# Altium schematic sheet 9.7-13.3.SchDoc
size A4
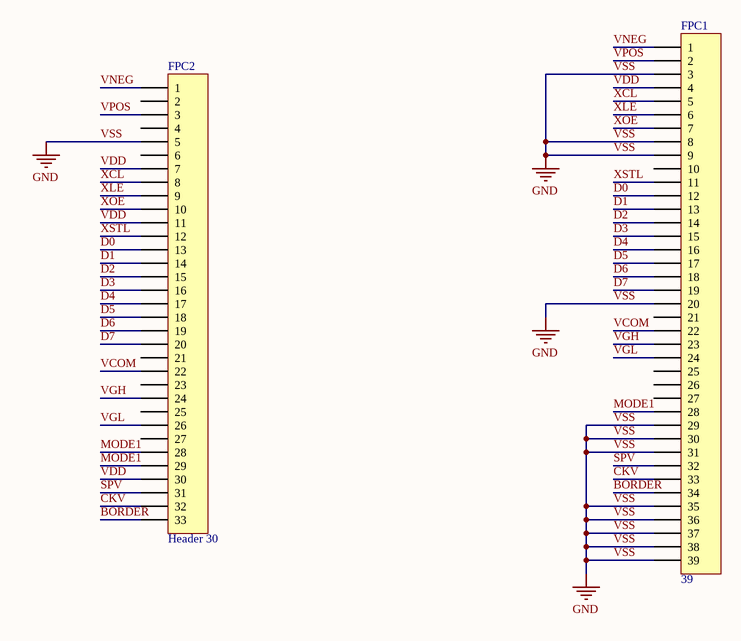
[diagram p0: 9.7-13.3.SchDoc]

## Parts
FPC1  39  [1]
FPC2  Header 30  [2]

## Nets
VSS: FPC1.3 FPC1.8 FPC1.9 FPC1.20 FPC1.29 FPC1.30 FPC1.31 FPC1.35 FPC1.36 FPC1.37 FPC1.38 FPC1.39 FPC2.5  [also labelled GND]
BORDER: FPC1.34 FPC2.33
CKV: FPC1.33 FPC2.32
D0: FPC1.12 FPC2.13
D1: FPC1.13 FPC2.14
D2: FPC1.14 FPC2.15
D3: FPC1.15 FPC2.16
D4: FPC1.16 FPC2.17
D5: FPC1.17 FPC2.18
D6: FPC1.18 FPC2.19
D7: FPC1.19 FPC2.20
MODE1: FPC1.28 FPC2.28 FPC2.29
SPV: FPC1.32 FPC2.31
VCOM: FPC1.22 FPC2.22
VDD: FPC1.4 FPC2.7 FPC2.11 FPC2.30
VGH: FPC1.23 FPC2.24
VGL: FPC1.24 FPC2.26
VNEG: FPC1.1 FPC2.1
VPOS: FPC1.2 FPC2.3
XCL: FPC1.5 FPC2.8
XLE: FPC1.6 FPC2.9
XOE: FPC1.7 FPC2.10
XSTL: FPC1.11 FPC2.12

Not connected (* = marked no-connect by the designer): FPC1 10 21 25 26 27; FPC2 2 4 6 21 23 25 27

## Library data of the parts
FPC2 = Header 33: Header, 30-Pin; LatestRevisionDate: 17-Jul-2002; LatestRevisionNote: Re-released for DXP Platform.; Publisher: Altium Limited